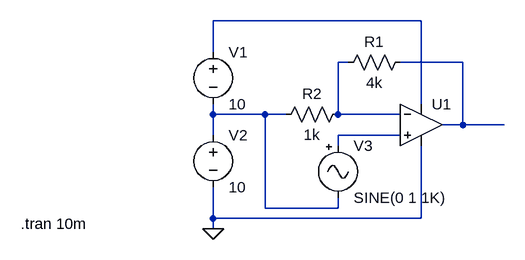
[diagram p0: schematic Ejemplo completo.asc]
Ejemplo completo.asc, the LTspice schematic file:
Version 4
SHEET 1 880 680
WIRE 560 128 240 128
WIRE 240 176 240 128
WIRE 448 192 432 192
WIRE 624 192 528 192
WIRE 560 256 560 128
WIRE 240 272 240 256
WIRE 320 272 240 272
WIRE 352 272 320 272
WIRE 432 272 432 192
WIRE 528 272 432 272
WIRE 624 288 624 192
WIRE 624 288 592 288
WIRE 688 288 624 288
WIRE 240 304 240 272
WIRE 528 304 432 304
WIRE 432 320 432 304
WIRE 320 416 320 272
WIRE 432 416 432 400
WIRE 432 416 320 416
WIRE 240 432 240 384
WIRE 560 432 560 320
WIRE 560 432 240 432
WIRE 240 448 240 432
FLAG 240 448 0
SYMBOL voltage 240 160 R0
WINDOW 123 0 0 Left 0
WINDOW 39 0 0 Left 0
SYMATTR InstName V1
SYMATTR Value 10
SYMBOL voltage 240 288 R0
WINDOW 123 0 0 Left 0
WINDOW 39 0 0 Left 0
SYMATTR InstName V2
SYMATTR Value 10
SYMBOL OpAmps\\UniversalOpAmp 560 288 R0
SYMATTR InstName U1
SYMBOL res 544 176 R90
WINDOW 0 0 56 VBottom 2
WINDOW 3 32 56 VTop 2
SYMATTR InstName R1
SYMATTR Value 4k
SYMBOL res 448 256 R90
WINDOW 0 0 56 VBottom 2
WINDOW 3 32 56 VTop 2
SYMATTR InstName R2
SYMATTR Value 1k
SYMBOL Misc\\signal 432 304 R0
WINDOW 123 0 0 Left 0
WINDOW 39 0 0 Left 0
SYMATTR InstName V3
TEXT -56 440 Left 2 !.tran 10m

The netlist it stands for:
* Ejemplo completo.asc
V1 N001 N004 10
V2 N004 0 10
XU1 N005 N002 N001 0 N003 level1 Avol=1Meg GBW=10Meg Vos=0 En=0 Enk=0 In=0 Ink=0 Rin=500Meg  ; pins In+ In- V+ V- OUT
R1 N003 N002 4k
R2 N002 N004 1k
V3 N005 N004 SINE(0 1 1K)
.tran 10m
.lib UniversalOpAmp1.lib
.backanno
.end